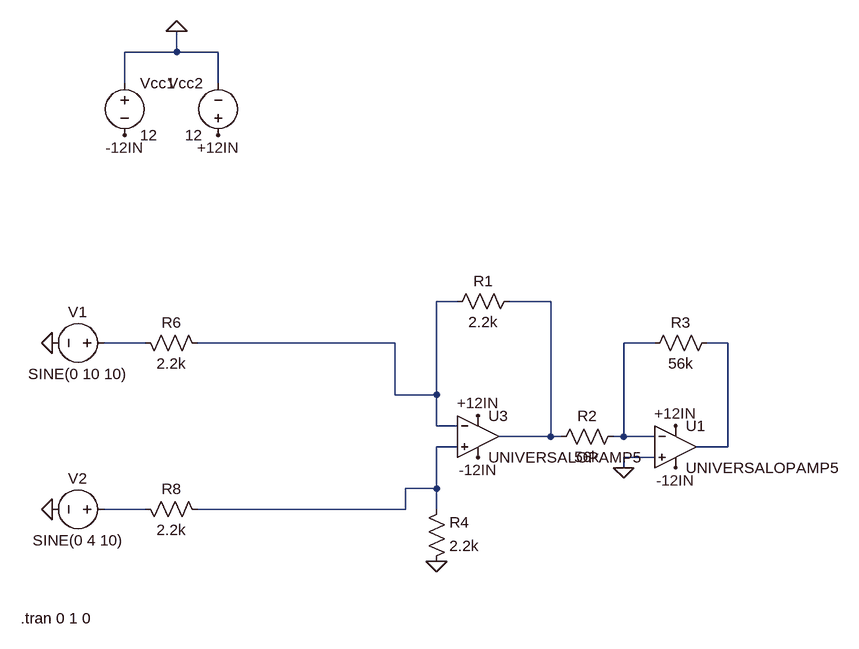
[diagram p0: schematic Subtractor Circuit.asc]
Subtractor Circuit.asc, the LTspice schematic file:
Version 4.1
SHEET 1 880 680
WIRE -64 -416 -64 -448
WIRE -64 -416 -144 -416
WIRE 0 -416 -64 -416
WIRE -144 -368 -144 -416
WIRE 0 -368 0 -416
WIRE 368 -32 336 -32
WIRE 512 -32 448 -32
WIRE -112 32 -176 32
WIRE 272 32 -32 32
WIRE 672 32 624 32
WIRE 784 32 752 32
WIRE 272 112 272 32
WIRE 336 112 336 -32
WIRE 336 112 272 112
WIRE 336 160 336 112
WIRE 368 160 336 160
WIRE 512 176 512 -32
WIRE 512 176 432 176
WIRE 528 176 512 176
WIRE 624 176 624 32
WIRE 624 176 608 176
WIRE 672 176 624 176
WIRE 368 192 336 192
WIRE 784 192 784 32
WIRE 784 192 736 192
WIRE 672 208 624 208
WIRE 624 224 624 208
WIRE 336 256 336 192
WIRE 336 256 288 256
WIRE -112 288 -176 288
WIRE 288 288 288 256
WIRE 288 288 -32 288
WIRE 336 288 336 256
FLAG -64 -448 0
FLAG 0 -288 +12IN
FLAG 400 144 +12IN
FLAG -144 -288 -12IN
FLAG 400 208 -12IN
FLAG 336 368 0
FLAG -256 32 0
FLAG -256 288 0
FLAG 624 224 0
FLAG 704 160 +12IN
FLAG 704 224 -12IN
SYMBOL OpAmps\\UniversalOpAmp5 400 176 R0
SYMATTR InstName U3
SYMBOL res 464 -48 R90
WINDOW 0 0 56 VBottom 2
WINDOW 3 32 56 VTop 2
SYMATTR InstName R1
SYMATTR Value 2.2k
SYMBOL res 320 384 M180
WINDOW 0 36 76 Left 2
WINDOW 3 36 40 Left 2
SYMATTR InstName R4
SYMATTR Value 2.2k
SYMBOL res -16 48 M270
WINDOW 0 32 56 VTop 2
WINDOW 3 0 56 VBottom 2
SYMATTR InstName R6
SYMATTR Value 2.2k
SYMBOL res -16 304 M270
WINDOW 0 32 56 VTop 2
WINDOW 3 0 56 VBottom 2
SYMATTR InstName R8
SYMATTR Value 2.2k
SYMBOL voltage -144 -384 R0
WINDOW 123 0 0 Left 0
WINDOW 39 0 0 Left 0
SYMATTR InstName Vcc1
SYMATTR Value 12
SYMBOL voltage 0 -272 R180
WINDOW 0 24 96 Left 2
WINDOW 3 24 16 Left 2
WINDOW 123 0 0 Left 0
WINDOW 39 0 0 Left 0
SYMATTR InstName Vcc2
SYMATTR Value 12
SYMBOL voltage -160 32 R90
WINDOW 0 -32 56 VBottom 2
WINDOW 3 32 56 VTop 2
WINDOW 123 0 0 Left 0
WINDOW 39 0 0 Left 0
SYMATTR InstName V1
SYMATTR Value SINE(0 10 10)
SYMBOL voltage -160 288 R90
WINDOW 0 -32 56 VBottom 2
WINDOW 3 32 56 VTop 2
WINDOW 123 0 0 Left 0
WINDOW 39 0 0 Left 0
SYMATTR InstName V2
SYMATTR Value SINE(0 4 10)
SYMBOL OpAmps\\UniversalOpAmp5 704 192 R0
SYMATTR InstName U1
SYMBOL res 624 160 R90
WINDOW 0 0 56 VBottom 2
WINDOW 3 32 56 VTop 2
SYMATTR InstName R2
SYMATTR Value 56k
SYMBOL res 768 16 R90
WINDOW 0 0 56 VBottom 2
WINDOW 3 32 56 VTop 2
SYMATTR InstName R3
SYMATTR Value 56k
TEXT -304 456 Left 2 !.tran 0 1 0

The netlist it stands for:
* Subtractor Circuit.asc
X§U3 N006 N001 +12IN -12IN N002 level5 Avol=1Meg GBW=10Meg Phimargin=45 SlewPos=10Meg SlewNeg=10Meg En=0 Enk=0 In=0 Ink=0 Rcm=500Meg Ccm=1p Rdiff=500k Cdiff=2p Ro=1k Vos=0 Ibp=2n Ibn=1n Iq=1m Rail=0 Ilimit=25m  ; UNIVERSALOPAMP5, pins In+ In- V+ V- OUT
R1 N002 N001 2.2k
R4 0 N006 2.2k
R6 N001 N003 2.2k
R8 N006 N007 2.2k
Vcc1 0 -12IN 12
Vcc2 +12IN 0 12
V1 N003 0 SINE(0 10 10)
V2 N007 0 SINE(0 4 10)
X§U1 0 N004 +12IN -12IN N005 level5 Avol=1Meg GBW=10Meg Phimargin=45 SlewPos=10Meg SlewNeg=10Meg En=0 Enk=0 In=0 Ink=0 Rcm=500Meg Ccm=1p Rdiff=500k Cdiff=2p Ro=1k Vos=0 Ibp=2n Ibn=1n Iq=1m Rail=0 Ilimit=25m  ; UNIVERSALOPAMP5, pins In+ In- V+ V- OUT
R2 N004 N002 56k
R3 N005 N004 56k
.tran 0 1 0
.backanno
.end